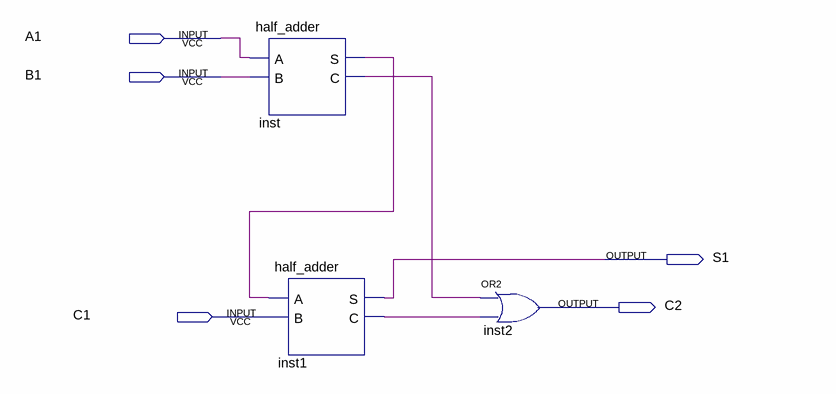
[diagram p0: schematic sheet]
// Quartus schematic full_adder.bdf as structural Verilog: 3 symbols, 5 pins
module full_adder (
  input  A1,
  input  B1,
  input  C1,
  output S1,
  output C2
);

  wire inst1_c, inst_c, inst_s;

  half_adder inst (.A(A1), .B(B1), .S(inst_s), .C(inst_c));
  half_adder inst1 (.A(inst_s), .B(C1), .S(S1), .C(inst1_c));
  or inst2 (C2, inst_c, inst1_c);
endmodule
